# EAGLE design salo (EAGLE 7.6.0)
DESIGNER: Max Vilimpoc
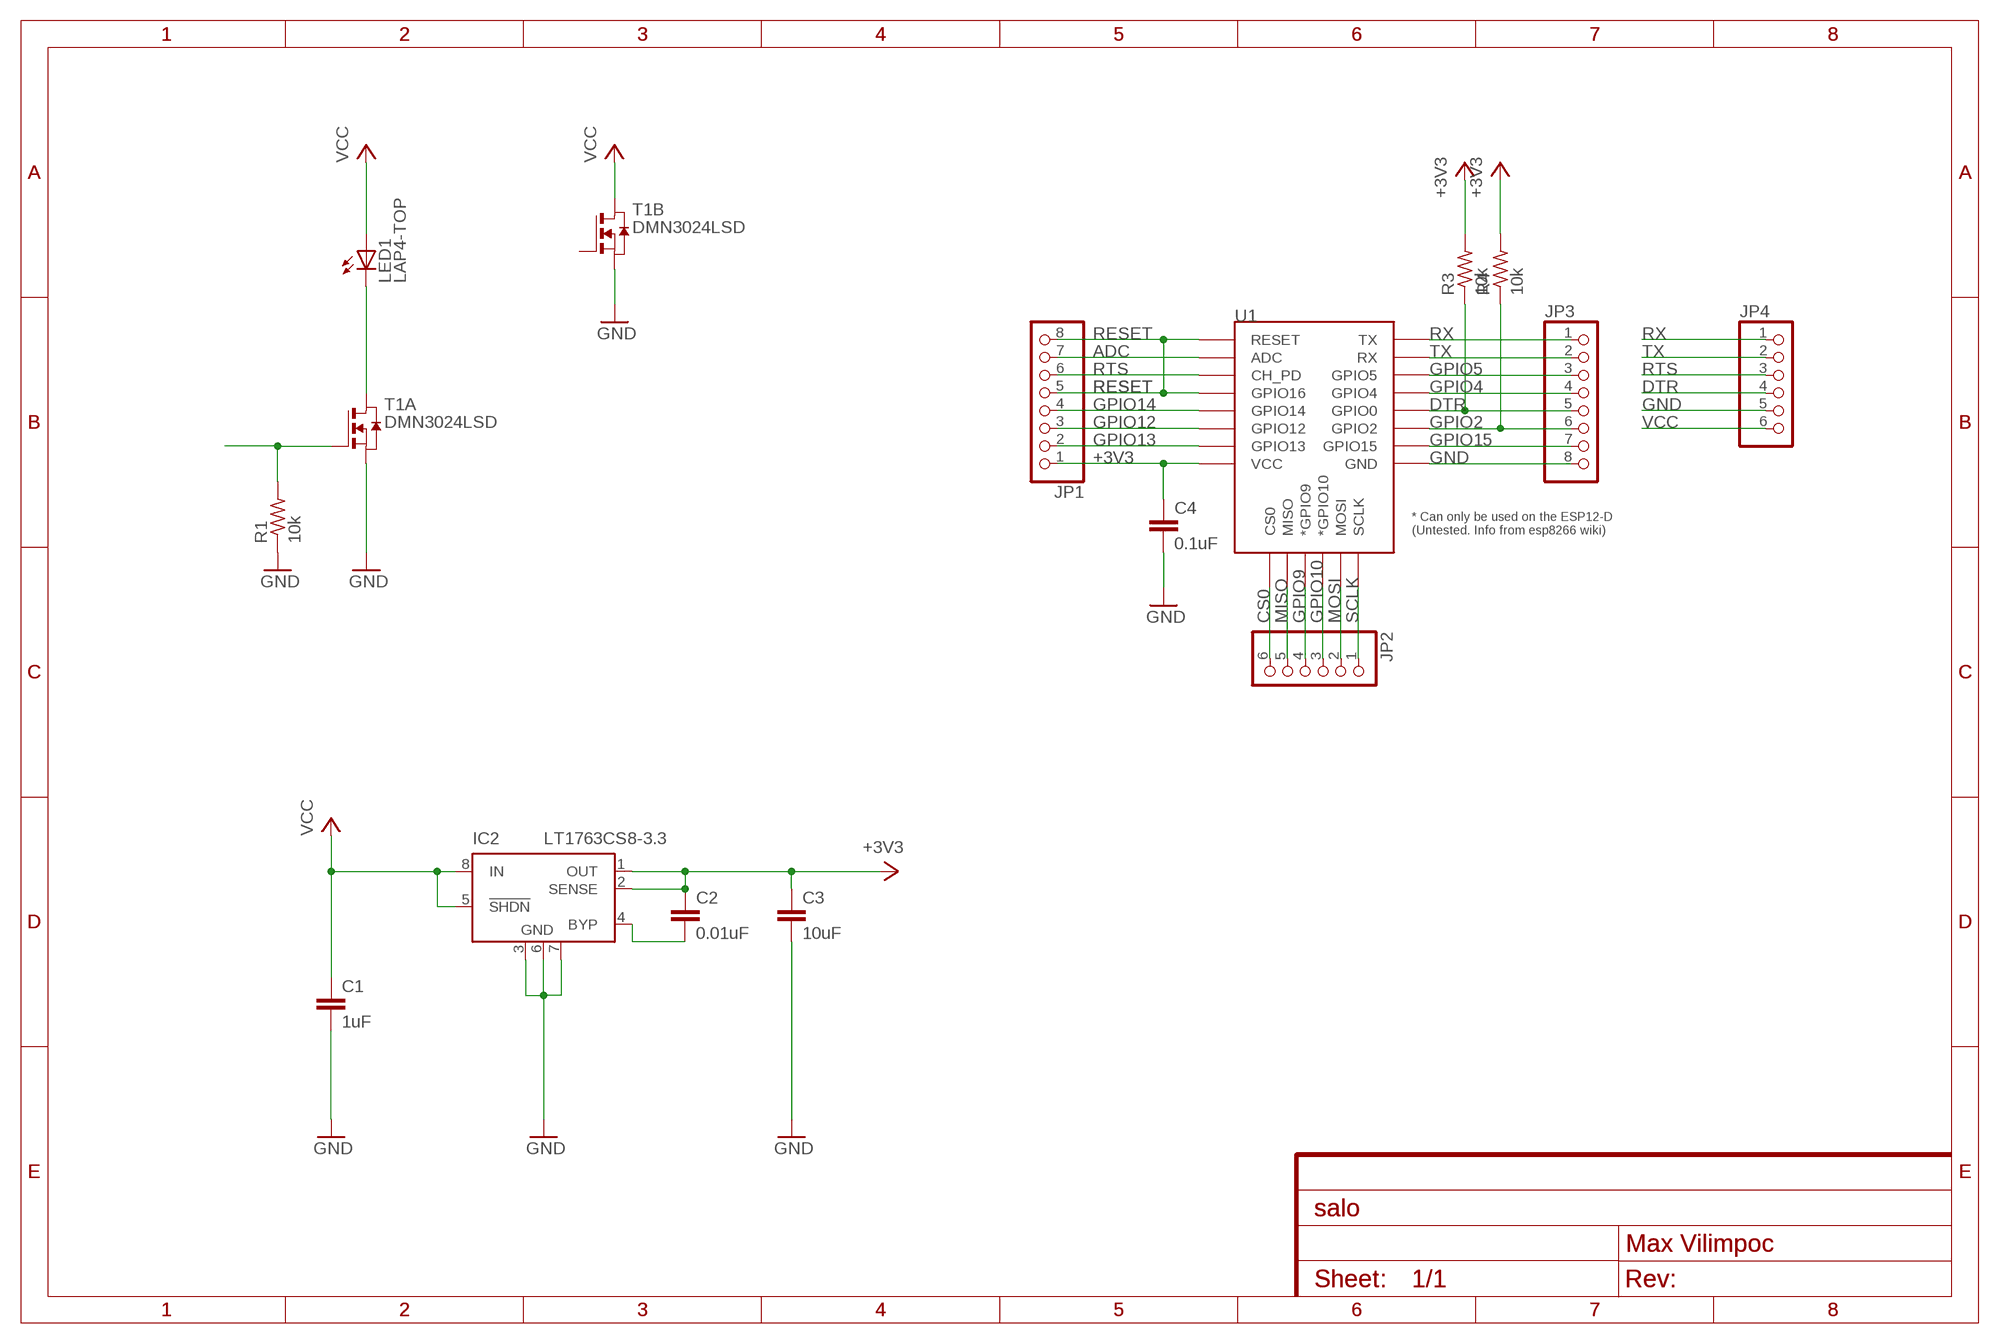
[diagram p0: schematic, sheet 1]

## Parts
C1  1uF  C-EUC0805  [C0805]
C2  0.01uF  C-EUC0805  [C0805]
C3  10uF  C-EUC0805  [C0805]
C4  0.1uF  C-EUC0805  [C0805]
IC2  LT1763CS8-3.3  [SOIC8]
JP1  PINHD-1X8  [1X08]
JP2  PINHD-1X6  [1X06]
JP3  PINHD-1X8  [1X08]
JP4  PINHD-1X6  [1X06]
LED1  LAP4-TOP  [P47F-TOP]
R1  10k  R-US_R0805  [R0805]
R3  10k  R-US_R0805  [R0805]
R4  10k  R-US_R0805  [R0805]
T1  DMN3024LSD  [SO8]
U1  ESP12ESMD  [ESP12E-SMD]

## Nets
+3V3: C2.1 C3.1 C4.1 IC2.1(OUT) IC2.2(SENSE) JP1.1 R3.2 R4.2 U1.VCC
ADC: JP1.7 U1.ADC
BYPASS: C2.2 IC2.4(BYP)
CS0: JP2.6 U1.CS0
DTR: JP3.5 JP4.4 R3.1 U1.GPIO0
GND: C1.2 C3.2 C4.2 IC2.3(GND) IC2.6(GND) IC2.7(GND) JP3.8 JP4.5 R1.1 T1.1(A:S) T1.3(B:S) U1.GND
GPIO2: JP3.6 R4.1 U1.GPIO2
GPIO4: JP3.4 U1.GPIO4
GPIO5: JP3.3 U1.GPIO5
GPIO9: JP2.4 U1.GPIO9(*GPIO9)
GPIO10: JP2.3 U1.GPIO10(*GPIO10)
GPIO12: JP1.3 U1.GPIO12
GPIO13: JP1.2 U1.GPIO13
GPIO14: JP1.4 U1.GPIO14
GPIO15: JP3.7 U1.GPIO15
MISO: JP2.5 U1.MISO
MOSI: JP2.2 U1.MOSI
N$2: R1.2 T1.2(A:G)
N$3: LED1.C T1.7(A:D) T1.8(A:D)
RESET: JP1.5 JP1.8 U1.GPIO16 U1.RESET
RTS: JP1.6 JP4.3 U1.CH_PD
RX: JP3.1 JP4.1 U1.TXD0(TX)
SCLK: JP2.1 U1.SCLK
TX: JP3.2 JP4.2 U1.RXD0(RX)
VCC: C1.1 IC2.5(!SHDN) IC2.8(IN) JP4.6 LED1.A T1.5(B:D) T1.6(B:D)
Unconnected: T1.4(B:G)

## Library data of the parts
C1-C4 = rcl:C-EU: CAPACITOR, European symbol
IC2 = linear-technology:LT1763CS8: 500mA, Low Noise, LDO Micropower Regulators Source: http://cds.linear.com/docs/Datasheet/1763ff.pdf; MPN: LT1763CS8-3.3; OC_FARNELL: 1273617; OC_NEWARK: 57M6055
JP1 JP3 = pinhead:PINHD-1X8: PIN HEADER
JP2 JP4 = pinhead:PINHD-1X6: PIN HEADER
LED1 = led:*P4: PointLED® Enhanced Thinfilm LED TOP & BOTTOM mount LS P47F, LR P47F, LA P47F, LY P47F, LT P4SG, LB P4SG, LW P4SG Source: http://catalog.osram-os.com .. LA_LR_LS_LY_P47F_Pb_free.pdf
R1 R3 R4 = rcl:R-US_: RESISTOR, American symbol
T1 = zetex:DMN3024LSD: 30V DUAL N-CHANNEL ENHANCEMENT MODE MOSFET Source: Data sheet <http://www.diodes.com/datasheets/DMN3024LSD.pdf>; OC_FARNELL: unknown; OC_NEWARK: unknown
U1 = esp8266modules:ESP12E: ESP12E Module

## Board
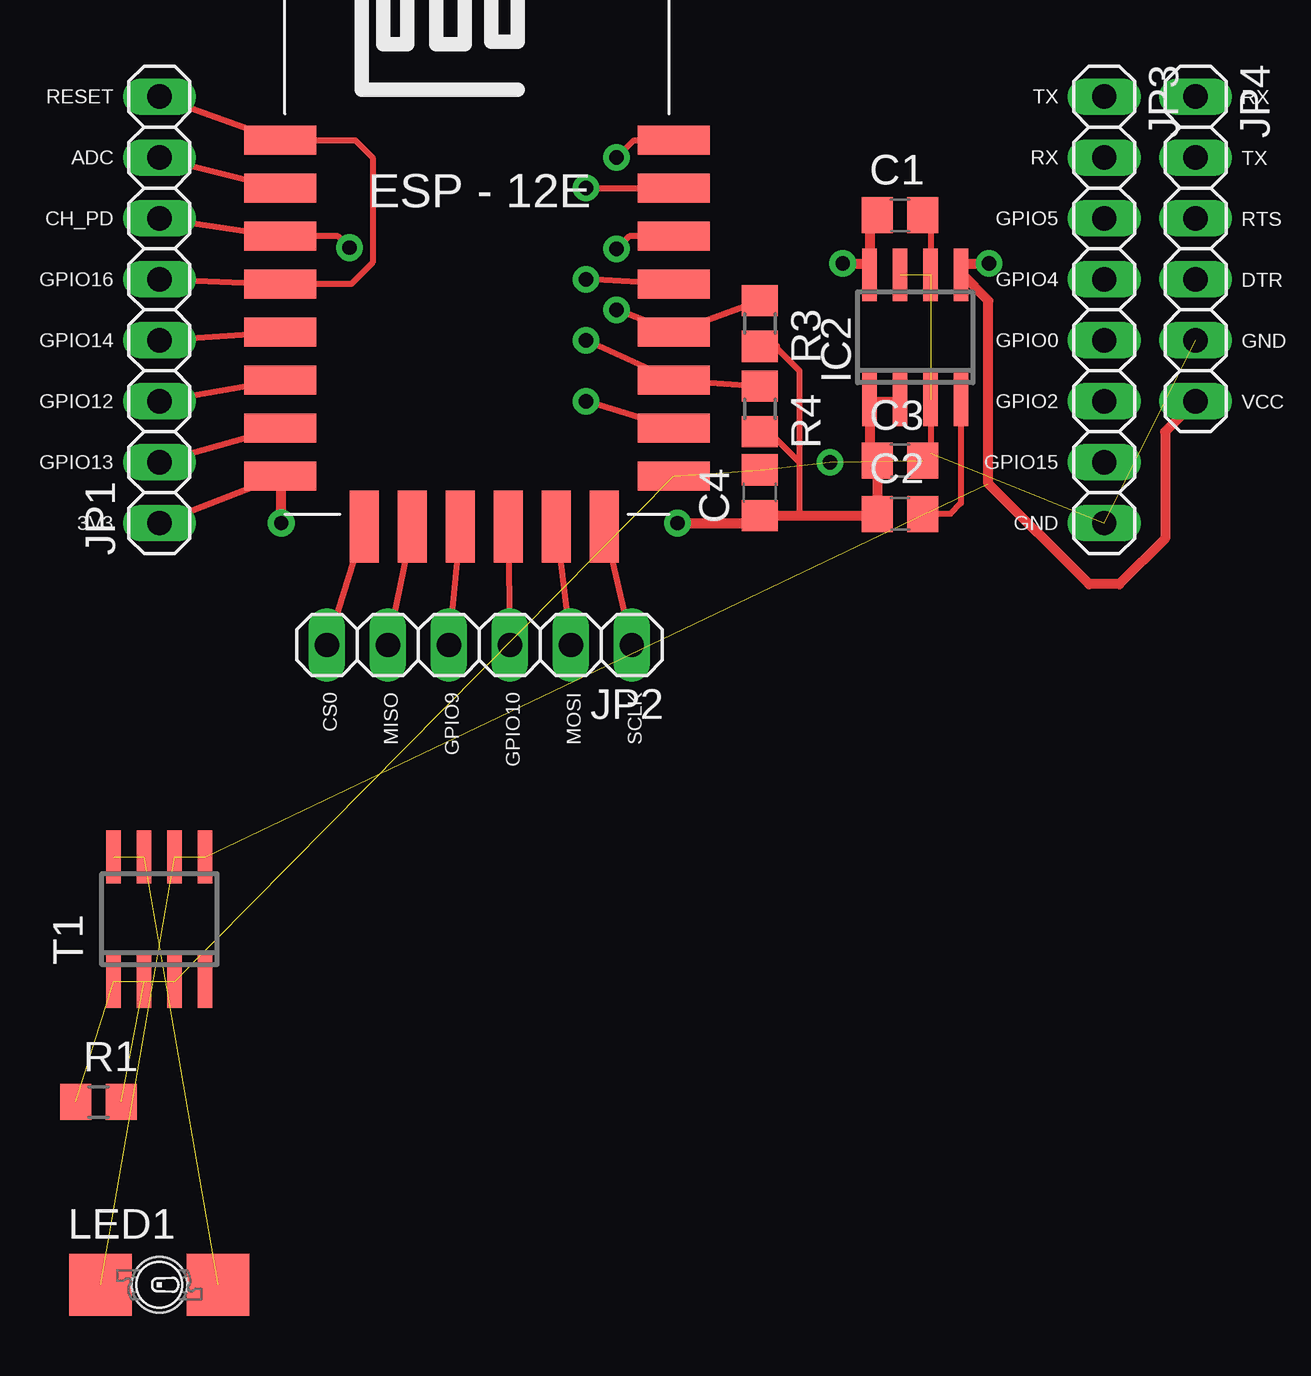
[diagram p1: board, top side]
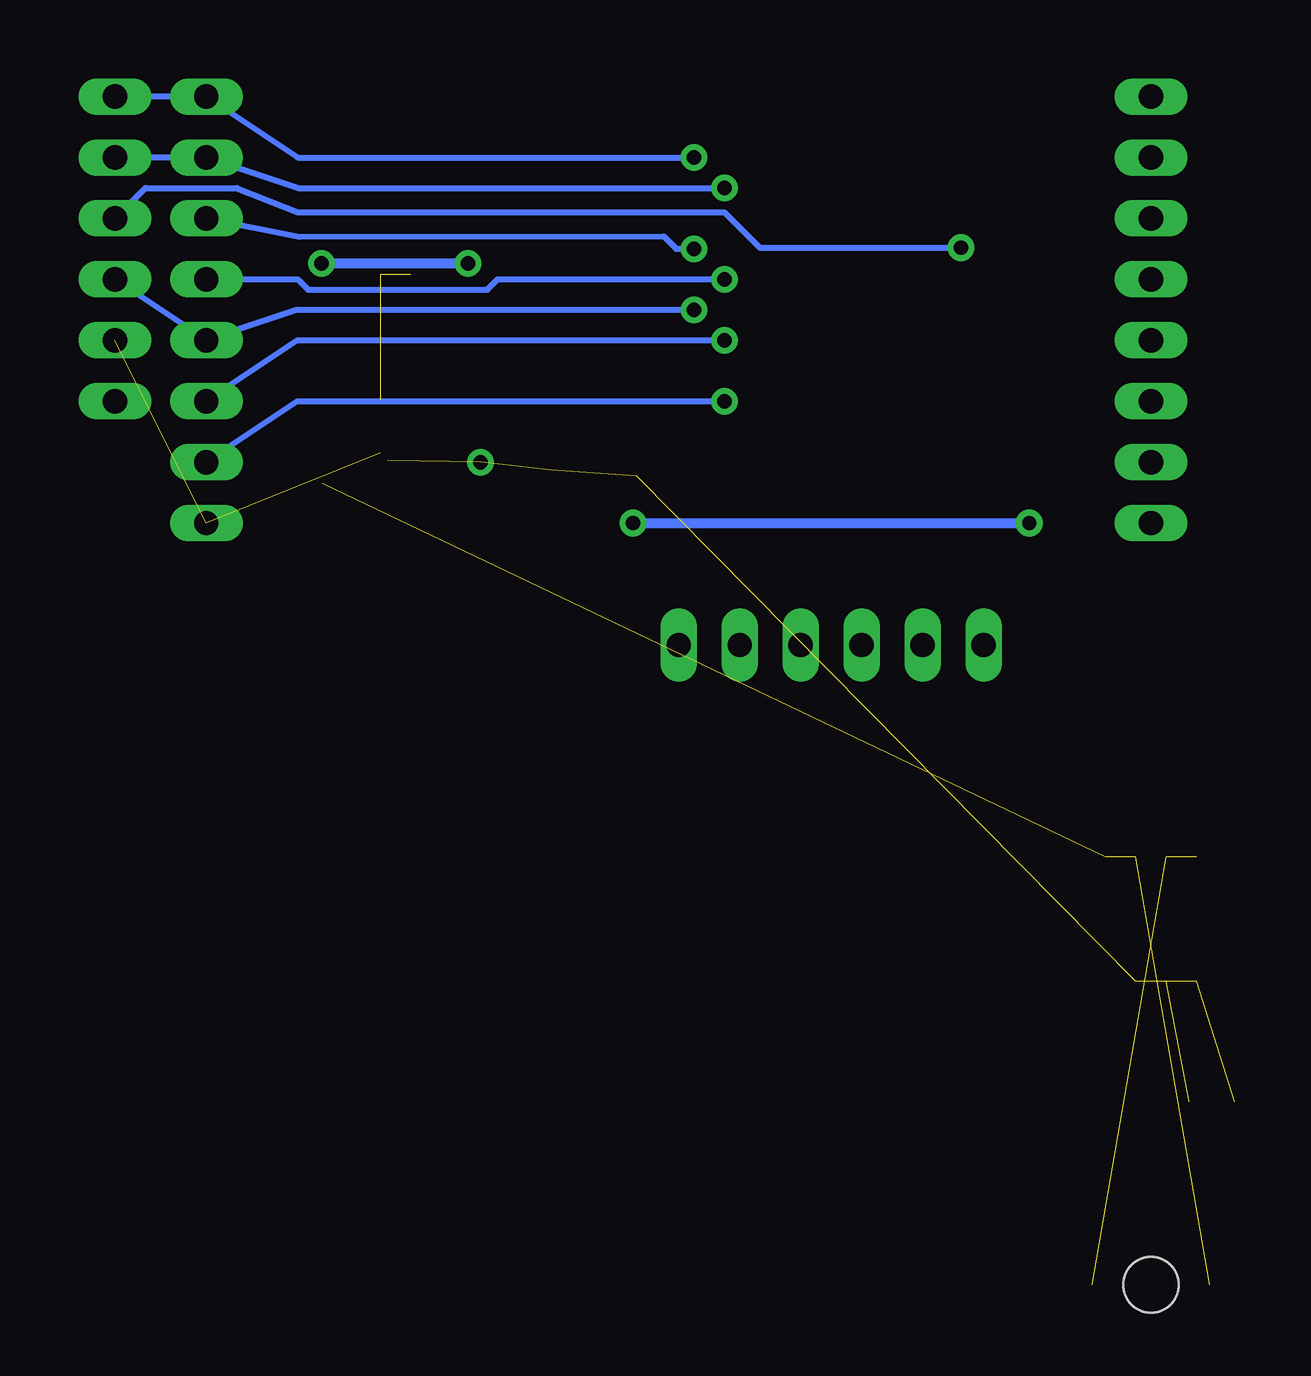
[diagram p2: board, bottom side, seen from below]

No outline drawn. Coordinates in mm, seen from the top.
Copper layers (1*16): Top 0.035mm / dielectric 1.5mm / Bottom 0.035mm
Design rules "SparkFun-2-layer-STANDARD": minimum track width 10mil, minimum drill 20mil, track to track 10mil, track to pad 8mil, pad to pad 8mil, via to via 10mil, smd to smd 8mil, copper to edge 8mil, drill to drill 8mil, minimum pad ring 10mil, minimum via ring 10mil, stop-mask expansion 4mil, vias tented up to drill 25mil, thermal gap 10mil

### Footprints (pad centres in the part's own frame; a part is rotated, then mirrored left to right if it is on the bottom)
C0805 = smd 1.3 x 1.5: 1 -0.95,0; 2 0.95,0
SOIC8 = smd 0.6 x 2.2: 1 -1.905,-2.6; 2 -0.635,-2.6; 3 0.635,-2.6; 4 1.905,-2.6; 5 1.905,2.6; 6 0.635,2.6; 7 -0.635,2.6; 8 -1.905,2.6
1X08 = drill 1.016 long: 1 -8.89,0; 2 -6.35,0; 3 -3.81,0; 4 -1.27,0; 5 1.27,0; 6 3.81,0; 7 6.35,0; 8 8.89,0
1X06 = drill 1.016 long: 1 -6.35,0; 2 -3.81,0; 3 -1.27,0; 4 1.27,0; 5 3.81,0; 6 6.35,0
P47F-TOP = smd 2.6 x 2.6: A -2.45,0; C 2.45,0 | hole 2.3: 0,0
R0805 = smd 1.3 x 1.5: 1 -0.95,0; 2 0.95,0
SO8 = smd 0.6 x 2.2: 1 -1.905,-2.6; 2 -0.635,-2.6; 3 0.635,-2.6; 4 1.905,-2.6; 5 1.905,2.6; 6 0.635,2.6; 7 -0.635,2.6; 8 -1.905,2.6
ESP12E-SMD = smd 3 x 1.2: ADC -8.3,3.8; CH_PD -8.3,1.8; GND 8.1,-8.2; GPIO0 8.1,-2.2; GPIO2 8.1,-4.2; GPIO4 8.1,-0.2; GPIO5 8.1,1.8; GPIO12 -8.3,-4.2; GPIO13 -8.3,-6.2; GPIO14 -8.3,-2.2; GPIO15 8.1,-6.2; GPIO16 -8.3,-0.2; RESET -8.3,5.8; RXD0 8.1,3.8; TXD0 8.1,5.8; VCC -8.3,-8.2 | smd 1.2 x 3: CS0 -4.8,-10.3; GPIO9 -0.8,-10.3; GPIO10 1.2,-10.3; MISO -2.8,-10.3; MOSI 3.2,-10.3; SCLK 5.2,-10.3

### Placement (x,y rotation side)
C1  61.34,29.34 0 top
C2  61.34,16.89 0 top
C3  61.34,19.11 0 top
C4  55.5,17.78 90 top
IC2  61.98,24.26 0 top
JP1  30.48,25.4 90 top
JP2  43.81,11.43 180 top
JP3  69.85,25.4 270 top
JP4  73.66,27.94 270 top
LED1  30.48,-15.24 0 top
R1  27.94,-7.62 0 top
R3  55.5,24.83 270 top
R4  55.5,21.27 270 top
T1  30.48,0 0 top
U1  43.81,26.67 0 top

### Tracks (layer width: path | path; a pad name or v marks a point on that pad's centre or on a via)
+3V3  (via drill 0.6)
  Top 0.254: IC2.1 IC2.2 | 60.07,19.43 C3.1 | 60.33,16.83 C2.1 | 35.56,18.43 U1.VCC JP1.1 | 55.5,16.51 C4.1 | 56.13,23.88 57.15,22.86 57.15,19.05 | 57.15,19.05 57.15,16.83 | R4.2 55.88,20.32 57.15,19.05
  Top 0.406: C3.1 C2.1 | IC2.1 60.07,19.43 | C4.1 57.15,16.83 60.33,16.83 | v35.56,16.51 35.56,18.43 | v52.07,16.51 55.5,16.51 | R3.2 56.13,23.88
  Bottom 0.406: v52.07,16.51 v35.56,16.51
ADC
  Top 0.254: JP1.7 U1.ADC
BYPASS
  Top 0.254: IC2.4 63.88,17.34 63.44,16.89 C2.2
CS0
  Top 0.254: U1.CS0 JP2.6
DTR  (via drill 0.6)
  Top 0.254: v49.53,25.4 U1.GPIO0 R3.1
  Bottom 0.254: v49.53,25.4 66.04,25.4 JP3.5 JP4.4
GND  (via drill 0.6)  (10 unrouted)
  Top 0.254: C1.2 62.61,29.34 IC2.6 | 55.5,18.47 C4.2 | IC2.3 62.61,19.43 C3.2
  other vias: 58.42,19.05
GPIO2  (via drill 0.6)
  Top 0.254: v48.26,24.13 U1.GPIO2 R4.1
  Bottom 0.254: v48.26,24.13 66.04,24.13 JP3.6
GPIO4  (via drill 0.6)
  Top 0.254: U1.GPIO4 v48.26,26.67
  Bottom 0.254: JP3.4 66.04,26.67 65.61,26.24 58.14,26.24 57.71,26.67 v48.26,26.67
GPIO5  (via drill 0.6)
  Top 0.254: U1.GPIO5 50.06,28.47 v49.53,27.94
  Bottom 0.254: JP3.3 65.98,28.45 50.8,28.47 50.27,27.94 v49.53,27.94
GPIO9
  Top 0.254: U1.GPIO9 JP2.4
GPIO10
  Top 0.254: U1.GPIO10 JP2.3
GPIO12
  Top 0.254: JP1.3 U1.GPIO12
GPIO13
  Top 0.254: JP1.2 U1.GPIO13
GPIO14
  Top 0.254: JP1.4 U1.GPIO14
GPIO15  (via drill 0.6)
  Top 0.254: U1.GPIO15 v48.26,21.59
  Bottom 0.254: v48.26,21.59 66.04,21.59 JP3.7
MISO
  Top 0.254: U1.MISO JP2.5
MOSI
  Top 0.254: U1.MOSI JP2.2
N$2  (1 unrouted)
N$3  (2 unrouted)
RESET
  Top 0.254: JP1.8 U1.RESET 38.65,32.47 39.37,31.75 39.37,27.37 38.48,26.48 U1.GPIO16 | JP1.5 U1.GPIO16
  Top 0.406: U1.GPIO16
RTS  (via drill 0.6)
  Top 0.254: JP1.6 U1.CH_PD 37.93,28.47 v38.41,27.99
  Bottom 0.254: JP4.3 72.39,30.48 68.58,30.48 66.04,29.46 48.26,29.46 46.79,27.99 v38.41,27.99 38.41,27.94
RX  (via drill 0.6)
  Top 0.254: v49.53,31.75 50.25,32.47 U1.TXD0
  Bottom 0.254: v49.53,31.75 66.04,31.75 JP3.1 JP4.1
SCLK
  Top 0.254: U1.SCLK JP2.1
TX  (via drill 0.6)
  Top 0.254: v48.26,30.48 v48.27,30.47 U1.RXD0
  Bottom 0.254: v48.26,30.48 66.04,30.48 JP3.2 JP4.2
VCC  (via drill 0.6)  (3 unrouted)
  Top 0.254: C1.1 60.07,29.34 | 63.95,26.86 IC2.5
  Top 0.406: JP4.6 72.39,20.32 72.39,15.88 70.48,13.97 69.22,13.97 65.02,18.16 65.02,25.78 63.95,26.86 63.95,27.51 64.13,27.33 v65.05,27.33 | 60.07,29.34 60.07,27.33 | 60.07,27.33 IC2.8 | v58.95,27.33 60.07,27.33
  Bottom 0.406: v58.95,27.33 v65.05,27.33

### Text on the board
tPlace: RESET | TX | RX | ADC | RX | TX | CH_PD | GPIO5 | RTS | GPIO16 | GPIO4 | DTR | GPIO14 | GPIO0 | GND | GPIO12 | GPIO2 | VCC | GPIO13 | GPIO15 | 3V3 | GND | CS0 | MISO | GPIO9 | GPIO10 | MOSI | SCLK